# EAGLE schematic FIPI_shematics (EAGLE 8.2.1)
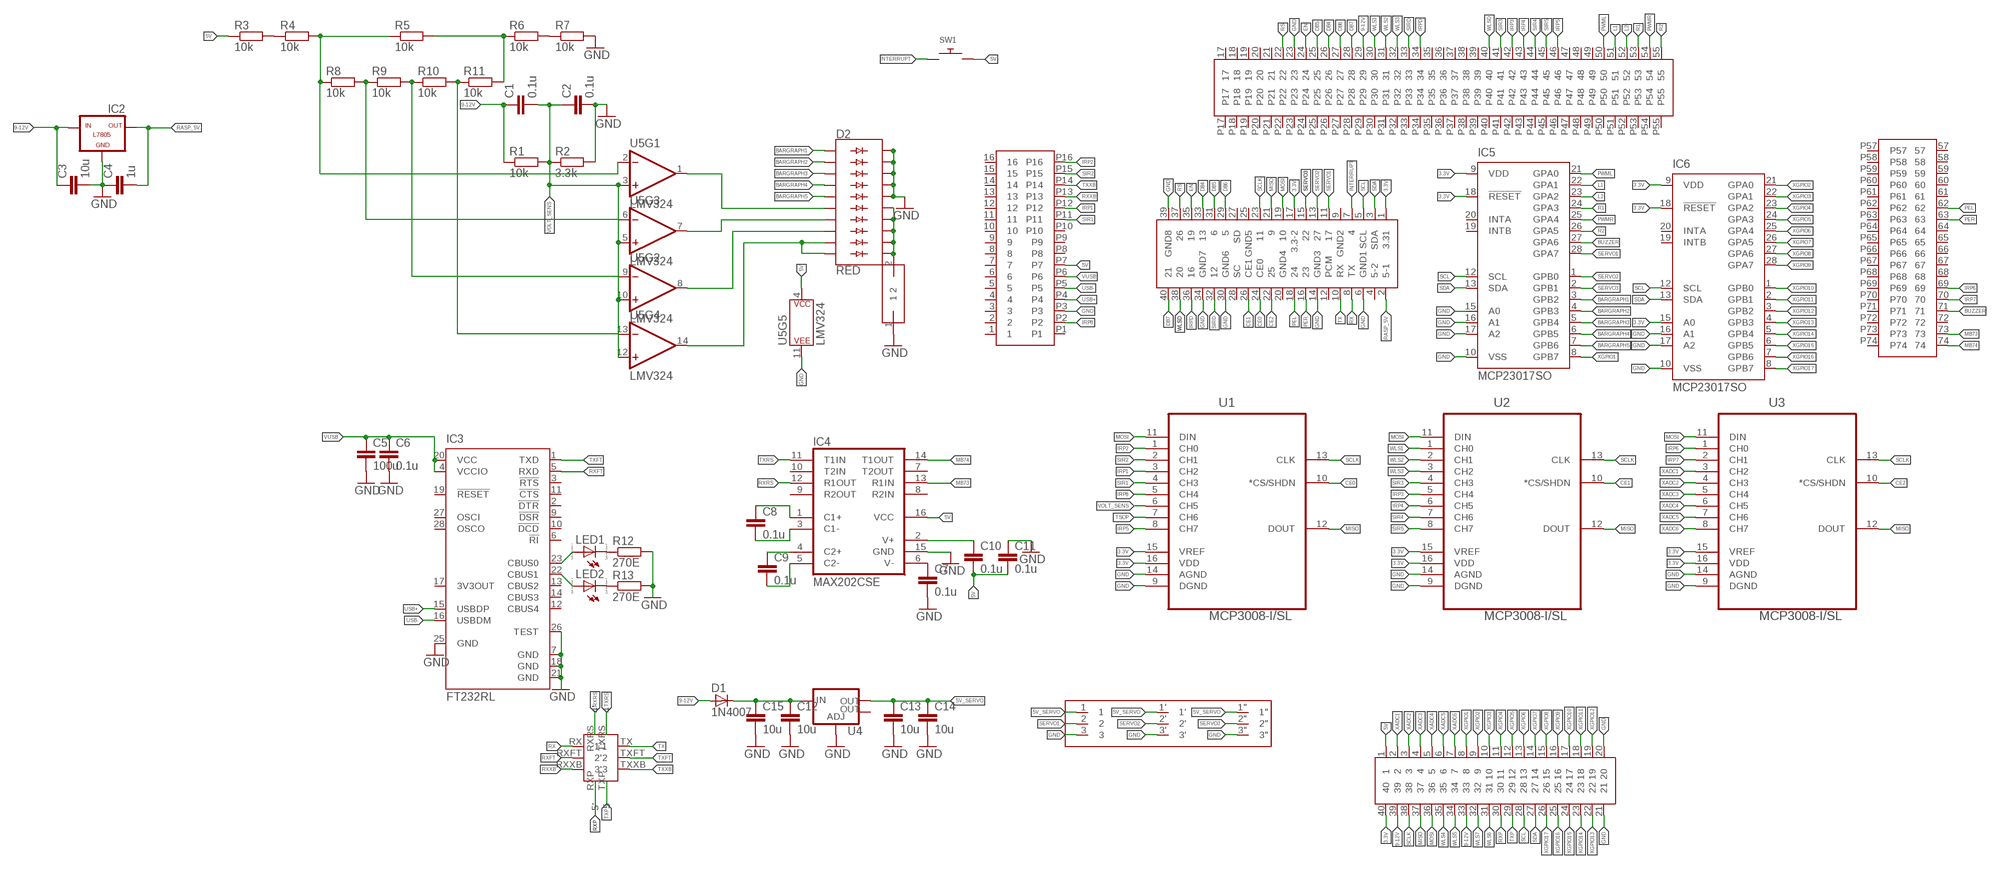
[diagram p0: schematic, sheet 1]

## Parts
C1  0.1u  C-EUC1206  [C1206]
C2  0.1u  C-EUC1206  [C1206]
C3  10u  C-EUC1206  [C1206]
C4  1u  C-EUC1206  [C1206]
C5  100u  C-EUC1206  [C1206]
C6  0.1u  C-EUC1206  [C1206]
C7  0.1u  C-EUC1206  [C1206]
C8  0.1u  C-EUC1206  [C1206]
C9  0.1u  C-EUC1206  [C1206]
C10  0.1u  C-EUC1206  [C1206]
C11  0.1u  C-EUC1206  [C1206]
C12  10u  C-EUC1206  [C1206]
C13  10u  C-EUC1206  [C1206]
C14  10u  C-EUC1206  [C1206]
C15  10u  C-EUC1206  [C1206]
D1  1N4007  [SMA]
D2  RED  LED_BARGRAPH_10RED  [LED_BARGRAPH_10]
IC2  L7805  [78XXL]
IC3  FT232RL  [SSOP28]
IC4  MAX202CSE  [SO16]
IC5  MCP23017SO  [SO28W]
IC6  MCP23017SO  [SO28W]
LED1  LED_E  [LED_1206]
LED2  LED_E  [LED_1206]
R1  10k  R-EU_M1206  [M1206]
R2  3.3k  R-EU_M1206  [M1206]
R3  10k  R-EU_M1206  [M1206]
R4  10k  R-EU_M1206  [M1206]
R5  10k  R-EU_M1206  [M1206]
R6  10k  R-EU_M1206  [M1206]
R7  10k  R-EU_M1206  [M1206]
R8  10k  R-EU_M1206  [M1206]
R9  10k  R-EU_M1206  [M1206]
R10  10k  R-EU_M1206  [M1206]
R11  10k  R-EU_M1206  [M1206]
R12  270E  R-EU_R1206  [R1206]
R13  270E  R-EU_R1206  [R1206]
RASPPI  MALE_HEADER  [MALE_HEADER_PACKAGE]
SW1  SWITCH_PUSHBUTTONSOFTTOUCHSMD_SJ  [PUSHBUTTON_SMD_SJ]
U1  MCP3008-I/SL  [SOIC127P600X175-16N]
U2  MCP3008-I/SL  [SOIC127P600X175-16N]
U3  MCP3008-I/SL  [SOIC127P600X175-16N]
U4  V_REG_LM1117SOT223  [SOT223]
U5  LMV324  [SO14]
U$1  BOARD  [FEMHEADER]
U$3  SWITCH_RXTX  [SWITCH_RXTX]
U$4  SWITCH1  [SWITCH1]
U$5  PORT_EXP  [PORT_EXP]
U$7  SERVO  [SERVO]

## Nets
3.3V [3.3v]: IC5.9(VDD) IC5.18(!RESET) IC6.9(VDD) IC6.15(A0) IC6.18(!RESET) RASPPI.1(3.31) RASPPI.17(3.3-2) U1.15(VREF) U1.16(VDD) U2.15(VREF) U2.16(VDD) U3.15(VREF) U3.16(VDD) U$5.40
5V [power]: C10.2 C11.2 IC4.16(VCC) R3.1 SW1.P$2 U5.4(P$V+) U$1.P7 U$5.1
5V_SERVO: C13.1 C14.1 U4.2(OUT) U$7.1 U$7.1" U$7.1'
9-12V [power]: C1.1 C3.1 D1.A IC2.IN R1.1 U$1.29 U$5.33 U$5.39
BARGRAPH1: D2.1(A) IC5.3(GPB2)
BARGRAPH2: D2.2(A1) IC5.4(GPB3)
BARGRAPH3: D2.3(A2) IC5.5(GPB4)
BARGRAPH4: D2.4(A3) IC5.6(GPB5)
BARGRAPH5: D2.5(A4) IC5.7(GPB6)
BUZZER: IC5.27(GPA6) U$1.71
CE0: RASPPI.24(CE0) U1.10(*CS/SHDN)
CE1: RASPPI.26(CE1) U2.10(*CS/SHDN)
CE2: RASPPI.22 U3.10(*CS/SHDN)
DB4: RASPPI.33 U$1.26
DB5: RASPPI.31 U$1.25
DB6: RASPPI.29 U$1.27
DB7: RASPPI.40 U$1.28
EN: RASPPI.35 U$1.24
GND [power]: C2.2 C3.2 C4.1 C5.2 C6.2 C7.2 C11.1 C12.2 C13.2 C14.2 C15.2 D2.16(C4) D2.17(C3) D2.18(C2) D2.19(C1) D2.20(C) IC2.GND IC3.7(GND) IC3.18(GND) IC3.21(GND) IC3.25(GND) IC3.26(TEST) IC4.15(GND) IC5.10(VSS) IC5.15(A0) IC5.16(A1) IC5.17(A2) IC6.10(VSS) IC6.16(A1) IC6.17(A2) R2.2 R7.2 R12.2 R13.2 RASPPI.6(GND1) RASPPI.14(GND3) RASPPI.30(GND6) RASPPI.34(GND7) RASPPI.39(GND8) U1.9(DGND) U1.14(AGND) U2.9(DGND) U2.14(AGND) U3.9(DGND) U3.14(AGND) U4.1(ADJ) U5.11(P$V-) U$1.23 U$1.P3 U$4.1 U$5.20 U$5.21 U$7.3 U$7.3" U$7.3'
INTERRUPT: RASPPI.7 SW1.P$1
IRP1: U1.3(CH2) U$1.P12
IRP2: U1.1(CH0) U$1.P16
IRP3: U2.5(CH4) U$1.42
IRP4: U2.6(CH5) U$1.43
IRP5: U1.8(CH7) U$1.46
IRP6: U3.1(CH0) U$1.69
IRP7: U3.2(CH1) U$1.70
IRP8: U1.5(CH4) U$1.P2
IRPD: RASPPI.36 U$1.34
L1: IC5.22(GPA1) U$1.51
L2: IC5.23(GPA2) U$1.52
MB73: IC4.13(R1IN) U$1.73
MB74: IC4.14(T1OUT) U$1.74
MISO: RASPPI.21 U1.12(DOUT) U2.12(DOUT) U3.12(DOUT) U$5.37
MOSI: RASPPI.19 U1.11(DIN) U2.11(DIN) U3.11(DIN) U$5.36
N$1: R3.2 R4.1
N$2: C12.1 C15.1 D1.K(C) U4.3(IN)
N$3: R4.2 R5.1 R8.1 U5.2(-IN)
N$4: R5.2 R6.1 R11.2
N$5: R6.2 R7.1
N$6: R8.2 R9.1 U5.6(-IN)
N$7: R9.2 R10.1 U5.9(-IN)
N$8: R10.2 R11.1 U5.13(-IN)
N$9: D2.11(C9) D2.12(C8) D2.13(C7) D2.14(C6) D2.15(C5) U$4.2
N$14: D2.9(A8) D2.10(A9) U5.14(OUT)
N$15: D2.8(A7) U5.8(OUT)
N$16: D2.7(A6) U5.7(OUT)
N$17: D2.6(A5) U5.1(OUT)
N$19: C8.1 IC4.1(C1+)
N$20: C8.2 IC4.3(C1-)
N$21: C9.1 IC4.4(C2+)
N$22: C9.2 IC4.5(C2-)
N$23: IC3.23(CBUS0) LED1.A
N$24: IC3.22(CBUS1) LED2.A
N$25: LED1.C R12.1
N$26: LED2.C R13.1
PEL: RASPPI.18 U$1.62
PER: RASPPI.16 U$1.63
PWML: IC5.21(GPA0) U$1.50
PWMR: IC5.25(GPA4) U$1.54
R1: IC5.24(GPA3) U$1.53
R2: IC5.26(GPA5) U$1.55
RASP_5V [power]: C4.2 IC2.OUT RASPPI.2(5-1)
RS: RASPPI.37 U$1.22
RX: RASPPI.8(TX) U$3.RX(1')
RXFT: IC3.5(RXD) U$3.RXFT(2')
RXP: U$3.RXP(5') U$5.30
RXRS: IC4.12(R1OUT) U$3.RXRS(4')
RXXB: U$1.P13 U$3.RXXB(3')
SCL: IC5.12(SCL) IC6.12(SCL) RASPPI.5(SCL) U$5.28
SCLK: RASPPI.23 U1.13(CLK) U2.13(CLK) U3.13(CLK) U$5.38
SDA: IC5.13(SDA) IC6.13(SDA) RASPPI.3(SDA) U$5.27
SERVO1: IC5.28(GPA7) RASPPI.11 U$7.2
SERVO2: IC5.1(GPB0) RASPPI.13 U$7.2'
SERVO3: IC5.2(GPB1) RASPPI.15 U$7.2"
SIR1: U1.4(CH3) U$1.P11
SIR2: U1.2(CH1) U$1.P15
SIR3: U2.4(CH3) U$1.41
SIR4: U2.7(CH6) U$1.44
SIR5: U2.8(CH7) U$1.45
SIRD: RASPPI.32 U$1.33
TSOP: U1.7(CH6)
TX: RASPPI.10(RX) U$3.TX
TXFT: IC3.1(TXD) U$3.TXFT
TXP: U$3.TXP U$5.29
TXRS: IC4.11(T1IN) U$3.TXRS
TXXB: U$1.P14 U$3.TXXB
USB+: IC3.15(USBDP) U$1.P4
USB-: IC3.16(USBDM) U$1.P5
V+: C10.1 IC4.2(V+)
V-: C7.1 IC4.6(V-)
VOLT_SENS: C1.2 C2.1 R1.2 R2.1 U1.6(CH5) U5.3(+IN) U5.5(+IN) U5.10(+IN) U5.12(+IN)
VUSB [power]: C5.1 C6.1 IC3.4(VCCIO) IC3.20(VCC) U$1.P6
WLS1: U2.1(CH0) U$1.30
WLS2: U2.2(CH1) U$1.31
WLS3: U2.3(CH2) U$1.32
WLS4: U$5.35
WLS5: U$5.34
WLS6: U$5.31
WLS7: U$5.32
WLSD: RASPPI.38 U$1.40
XADC1: U3.3(CH2) U$5.2
XADC2: U3.4(CH3) U$5.3
XADC3: U3.5(CH4) U$5.4
XADC4: U3.6(CH5) U$5.5
XADC5: U3.7(CH6) U$5.6
XADC6: U3.8(CH7) U$5.7
XGPIO1: IC5.8(GPB7) U$5.8
XGPIO2: IC6.21(GPA0) U$5.9
XGPIO3: IC6.22(GPA1) U$5.10
XGPIO4: IC6.23(GPA2) U$5.11
XGPIO5: IC6.24(GPA3) U$5.12
XGPIO6: IC6.25(GPA4) U$5.13
XGPIO7: IC6.26(GPA5) U$5.14
XGPIO8: IC6.27(GPA6) U$5.15
XGPIO9: IC6.28(GPA7) U$5.16
XGPIO10: IC6.1(GPB0) U$5.17
XGPIO11: IC6.2(GPB1) U$5.18
XGPIO12: IC6.3(GPB2) U$5.19
XGPIO13: IC6.4(GPB3) U$5.22
XGPIO14: IC6.5(GPB4) U$5.23
XGPIO15: IC6.6(GPB5) U$5.24
XGPIO16: IC6.7(GPB6) U$5.25
XGPIO17: IC6.8(GPB7) U$5.26
Unconnected: IC3.2(!DTR) IC3.3(!RTS) IC3.6(!RI) IC3.9(!DSR) IC3.10(!DCD) IC3.11(!CTS) IC3.12(CBUS4) IC3.13(CBUS2) IC3.14(CBUS3) IC3.17(3V3OUT) IC3.19(!RESET) IC3.27(OSCI) IC3.28(OSCO) IC4.7(T2OUT) IC4.8(R2IN) IC4.9(R2OUT) IC4.10(T2IN) IC5.19(INTB) IC5.20(INTA) IC6.19(INTB) IC6.20(INTA) RASPPI.4(5-2) RASPPI.9(GND2) RASPPI.12(PCM) RASPPI.20(GND4) RASPPI.25(GND5) RASPPI.27(SD) RASPPI.28(SC) U4.4(OUT) U$1.1 U$1.2 U$1.3 U$1.4 U$1.5 U$1.6 U$1.7 U$1.8 U$1.9 U$1.10 U$1.11 U$1.12 U$1.13 U$1.14 U$1.15 U$1.16 U$1.17 U$1.18 U$1.19 U$1.20 U$1.21 U$1.35 U$1.36 U$1.37 U$1.38 U$1.39 U$1.47 U$1.48 U$1.49 U$1.57 U$1.58 U$1.59 U$1.60 U$1.61 U$1.64 U$1.65 U$1.66 U$1.67 U$1.68 U$1.72 U$1.P1 U$1.P8 U$1.P9 U$1.P10 U$1.P17 U$1.P18 U$1.P19 U$1.P20 U$1.P21 U$1.P22 U$1.P23 U$1.P24 U$1.P25 U$1.P26 U$1.P27 U$1.P28 U$1.P29 U$1.P30 U$1.P31 U$1.P32 U$1.P33 U$1.P34 U$1.P35 U$1.P36 U$1.P37 U$1.P38 U$1.P39 U$1.P40 U$1.P41 U$1.P42 U$1.P43 U$1.P44 U$1.P45 U$1.P46 U$1.P47 U$1.P48 U$1.P49 U$1.P50 U$1.P51 U$1.P52 U$1.P53 U$1.P54 U$1.P55 U$1.P57 U$1.P58 U$1.P59 U$1.P60 U$1.P61 U$1.P62 U$1.P63 U$1.P64 U$1.P65 U$1.P66 U$1.P67 U$1.P68 U$1.P69 U$1.P70 U$1.P71 U$1.P72 U$1.P73 U$1.P74

## Library data of the parts
C1-C15 = rcl:C-EU: CAPACITOR, European symbol
D1 = casovac:1N4007
D2 = SparkFun-LED:LED_BARGRAPH_10: Young Sun LED Tech - YSLB-10251G5-10 10-Segment LED Bar Graph Features: Red Vf = 2.1V, Ifmax = 20mA Yellow Vf = 2.1V, Ifmax = 20mA Blue Vf = 3.4V, Ifmax = 20mA Green Vf = 3.4V, Ifmax = 20mA SparkFun Products: Red <https://www.sparkfun.com/products/9935> Yellow <https://www.sparkfun.com/products/9936> Green <https://www.sparkfun.com/products/9938> Blue <https://www.sparkfun.com/products/9937>; PROD_ID: DIO-10615
IC2 = tango:L7805: VOLTAGE REGULATOR
IC3 = ftdichip:FT232R: Source: http://www.ftdichip.com/Documents/DataSheets/DS_FT232R_v104.pdf; MPN: FT232RL; OC_FARNELL: 1146032; OC_NEWARK: 91K9918
IC4 = maxim-8:MAX202*: RS232 TRANSEIVER
IC5 IC6 = adafruit:MCP23017: http://ww1.microchip.com/downloads/en/DeviceDoc/21952a.pdf Source: http://ww1.microchip.com/downloads/en/DeviceDoc/21952a.pdf
LED1 LED2 = eagle-ltspice:LED_E: LED Source: http://www.osram.convergy.de Source: www.luxeon.com Source: www.kingbright.com; SPICEMODEL: NONE; SPICEPREFIX: D; SPICETYPE: diode
R1-R13 = resistor:R-EU_: RESISTOR, European symbol
RASPPI = male_header_device:MALE_HEADER
SW1 = adafruit:SWITCH_PUSHBUTTON: Buttons SOFTTOUCHSMD_SJ - Soft touch temporary push button (Super Junk Akihabara) Compatible with SKPMANE010 [Mouser: 688-SKPMAN] C&K_KSS = Digikey: KSS221GLFS
U1-U3 = MCP3008-I_SL:MCP3008-I/SL: 10BIT ADC, 8 CH, SPI, SMD; AVAILABILITY: Good; DESCRIPTION: Eight Channel SPI Serial Interface 2.7 V 10-Bit A/D Converter SMT - SOIC-16; MF: Microchip; MP: MCP3008-I/SL; PACKAGE: SOIC-16 Microchip; PRICE: 2.02 USD
U4 = SparkFun-IC-Power:V_REG_LM1117: Voltage Regulator LM1117 Standard adjustable voltage regulator but in SMD form. Spark Fun Electronics SKU : COM-00595; PROD_ID: VREG-08170
U5 = SparkFun-IC-Amplifiers:LMV324: IC LMV324 Quad Op Amp Jellybean quad op-amp Datasheet <http://cdn.sparkfun.com/datasheets/Sensors/Sound/LMV324.pdf> SparkFun Products SparkFun Sensor Kit <https://www.sparkfun.com/products/13754> (DEV-13754) SparkFun Inventor's Kit for Arduino 101 <https://www.sparkfun.com/products/13844> (KIT-13844) SparkFun Sound Detector <https://www.sparkfun.com/products/12642> (SEN-12642); PROD_ID: IC-08227
U$1 = fem_header:BOARD
U$3 = switch:SWITCH_RXTX
U$4 = switch:SWITCH1
U$5 = fem_header:PORT_EXP
U$7 = switch:SERVO

## Net classes
0 default: width 0.25 mm, clearance 0.2 mm
1 power: width 0.8 mm, clearance 0.2 mm
2 3.3v: width 0.6 mm, clearance 0.2 mm